# EAGLE schematic TH555-MainBoard (EAGLE 7.5.0)
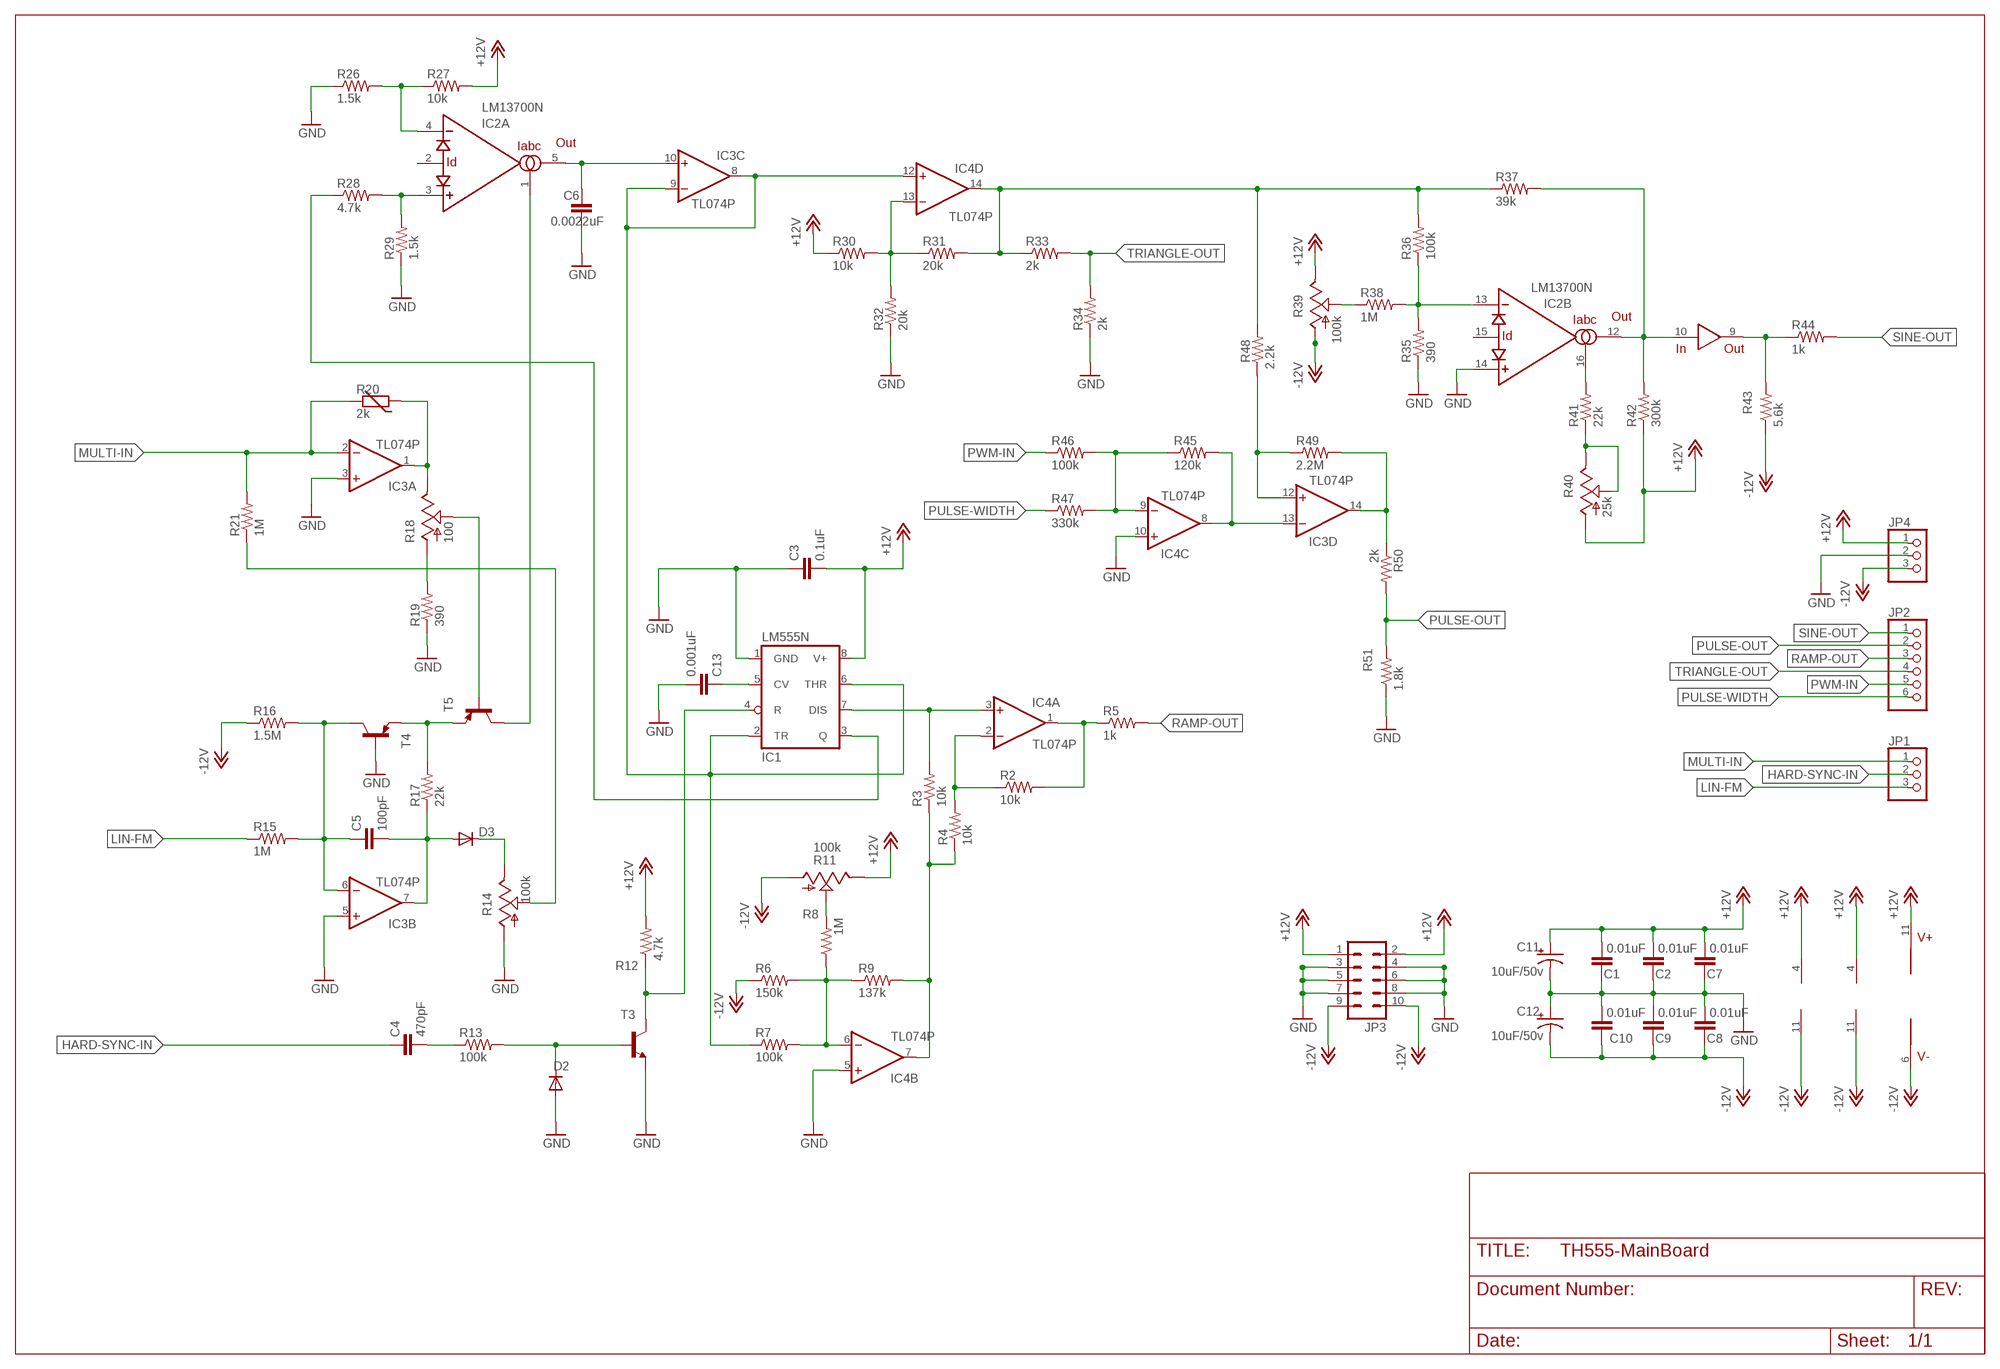
[diagram p0: schematic, sheet 1]

## Parts
C1  0.01uF  C-EU050-024X044  [C050-024X044]
C2  0.01uF  C-EU050-024X044  [C050-024X044]
C3  0.1uF  C-EU050-024X044  [C050-024X044]
C4  470pF  C-EU050-024X044  [C050-024X044]
C5  100pF  C-EU050-024X044  [C050-024X044]
C6  0.0022uF  C-EU050-025X075  [C050-025X075]
C7  0.01uF  C-EU050-024X044  [C050-024X044]
C8  0.01uF  C-EU050-024X044  [C050-024X044]
C9  0.01uF  C-EU050-024X044  [C050-024X044]
C10  0.01uF  C-EU050-024X044  [C050-024X044]
C11  10uF/50v  CPOL-USE2.5-6  [E2,5-6]
C12  10uF/50v  CPOL-USE2.5-6  [E2,5-6]
C13  0.001uF  C-EU050-024X044  [C050-024X044]
D2  1N4148DO35-7  [DO35-7]
D3  1N4148DO35-7  [DO35-7]
IC1  LM555N  [DIL08]
IC2  LM13700N  [DIL16]
IC3  TL074P  [DIL14]
IC4  TL074P  [DIL14]
JP1  PINHD-1X3  [1X03]
JP2  PINHD-1X6  [1X06]
JP3  ML10  [ML10]
JP4  PINHD-1X3  [1X03]
R2  10k  R-US_0204/7  [0204/7]
R3  10k  R-US_0204/7  [0204/7]
R4  10k  R-US_0204/7  [0204/7]
R5  1k  R-US_0204/7  [0204/7]
R6  150k  R-US_0204/7  [0204/7]
R7  100k  R-US_0204/7  [0204/7]
R8  1M  R-US_0204/7  [0204/7]
R9  137k  R-US_0204/7  [0204/7]
R11  100k  TRIM_US-RJ9W  [RJ9W]
R12  4.7k  R-US_0204/7  [0204/7]
R13  100k  R-US_0204/7  [0204/7]
R14  100k  TRIM_US-RJ9W  [RJ9W]
R15  1M  R-US_0204/7  [0204/7]
R16  1.5M  R-US_0204/7  [0204/7]
R17  22k  R-US_0204/7  [0204/7]
R18  100  TRIM_US-RJ9W  [RJ9W]
R19  390  R-US_0204/7  [0204/7]
R20  2k  THERMISTOR-5  [R-5]
R21  1M  R-US_0204/7  [0204/7]
R26  1.5k  R-US_0204/7  [0204/7]
R27  10k  R-US_0204/7  [0204/7]
R28  4.7k  R-US_0204/7  [0204/7]
R29  1.5k  R-US_0204/7  [0204/7]
R30  10k  R-US_0204/7  [0204/7]
R31  20k  R-US_0204/7  [0204/7]
R32  20k  R-US_0204/7  [0204/7]
R33  2k  R-US_0204/7  [0204/7]
R34  2k  R-US_0204/7  [0204/7]
R35  390  R-US_0204/7  [0204/7]
R36  100k  R-US_0204/7  [0204/7]
R37  39k  R-US_0204/7  [0204/7]
R38  1M  R-US_0204/7  [0204/7]
R39  100k  TRIM_US-RJ9W  [RJ9W]
R40  25k  TRIM_US-RJ9W  [RJ9W]
R41  22k  R-US_0204/7  [0204/7]
R42  300k  R-US_0204/7  [0204/7]
R43  5.6k  R-US_0204/7  [0204/7]
R44  1k  R-US_0204/7  [0204/7]
R45  120k  R-US_0204/7  [0204/7]
R46  100k  R-US_0204/7  [0204/7]
R47  330k  R-US_0204/7  [0204/7]
R48  2.2k  R-US_0204/7  [0204/7]
R49  2.2M  R-US_0204/7  [0204/7]
R50  2k  R-US_0204/7  [0204/7]
R51  1.8k  R-US_0204/7  [0204/7]
T3  2N3904-NPN-TO92-EBC  [TO92-EBC]
T4  2N3906-PNP-TO92-EBC  [TO92-EBC]
T5  2N3906-PNP-TO92-EBC  [TO92-EBC]

## Nets
+12V: C1.2 C2.2 C3.2 C7.2 C11.+ IC1.8(V+) IC2.11(V+) IC3.4(P:V+) IC4.4(P:V+) JP3.1 JP3.2 JP4.1 R11.E R12.2 R27.2 R30.1 R39.E R40.A R42.1
-12V: C8.1 C9.1 C10.1 C12.- IC2.6(V-) IC3.11(P:V-) IC4.11(P:V-) JP3.9 JP3.10 JP4.3 R6.1 R11.A R16.1 R39.A R43.1
GND: C1.1 C2.1 C3.1 C6.2 C7.1 C8.2 C9.2 C10.2 C11.- C12.+ C13.1 D2.A IC1.1(GND) IC2.14(B:+IN) IC3.3(A:+IN) IC3.5(B:+IN) IC4.5(B:+IN) IC4.10(C:+IN) JP3.3 JP3.4 JP3.5 JP3.6 JP3.7 JP3.8 JP4.2 R14.A R19.1 R26.1 R29.1 R32.1 R34.1 R35.1 R51.1 T3.E T4.B
HARD-SYNC-IN: C4.1 JP1.2
LIN-FM: JP1.3 R15.1
MULTI-IN: IC3.2(A:-IN) JP1.1 R20.2 R21.2
N$1: IC1.7(DIS) IC4.3(A:+IN) R3.2
N$2: IC4.2(A:-IN) R2.1 R4.2
N$3: IC4.1(A:OUT) R2.2 R5.1
N$4: IC4.7(B:OUT) R3.1 R4.1 R9.2
N$5: IC4.6(B:-IN) R6.2 R7.2 R8.1 R9.1
N$7: R38.1 R39.S
N$8: C5.1 IC3.6(B:-IN) R15.2 R16.2 T4.C
N$9: R8.2 R11.S
N$10: C5.2 D3.A IC3.7(B:OUT) R17.1
N$11: C4.2 R13.1
N$12: D2.C R13.2 T3.B
N$13: IC1.4(R) R12.1 T3.C
N$14: R17.2 T4.E T5.E
N$15: D3.C R14.E
N$16: R14.S R21.1
N$17: IC3.1(A:OUT) R18.E R20.1
N$18: R18.S T5.B
N$19: IC2.1(A:IABC) T5.C
N$20: R18.A R19.2
N$22: IC2.3(A:+IN) R28.2 R29.2
N$23: IC1.3(Q) R28.1
N$24: IC2.4(A:-IN) R26.2 R27.1
N$25: C6.1 IC2.5(A:OUT) IC3.10(C:+IN)
N$26: IC1.2(TR) IC1.6(THR) IC3.8(C:OUT) IC3.9(C:-IN) IC4.12(D:+IN) R7.1
N$27: IC4.13(D:-IN) R30.2 R31.1 R32.2
N$28: IC2.13(B:-IN) R35.2 R36.1 R38.2
N$29: IC4.14(D:OUT) R31.2 R33.1 R36.2 R37.1 R48.2
N$30: IC2.16(B:IABC) R41.2
N$31: R40.E R40.S R41.1
N$32: IC2.10(IN) IC2.12(B:OUT) R37.2 R42.2
N$33: IC2.9(OUT) R43.2 R44.1
N$34: IC3.13(D:-IN) IC4.8(C:OUT) R45.2
N$35: C13.2 IC1.5(CV)
N$37: IC4.9(C:-IN) R45.1 R46.2 R47.2
N$41: IC3.12(D:+IN) R48.1 R49.1
N$42: IC3.14(D:OUT) R49.2 R50.1
PULSE-OUT: JP2.2 R50.2 R51.2
PULSE-WIDTH: JP2.6 R47.1
PWM-IN: JP2.5 R46.1
RAMP-OUT: JP2.3 R5.2
SINE-OUT: JP2.1 R44.2
TRIANGLE-OUT: JP2.4 R33.2 R34.2
Unconnected: IC2.2(A:ID) IC2.7(IN) IC2.8(OUT) IC2.15(B:ID)

## Library data of the parts
C1-C10 C13 = resistor:C-EU: CAPACITOR, European symbol
C11 C12 = resistor:CPOL-US: POLARIZED CAPACITOR, American symbol
D2 D3 = diode:1N4148: DIODE high speed (Philips)
IC1 = linear:*555: TIMER
IC2 = synthdiy:LM13700: National Dual OTA with buffers.
IC3 IC4 = linear:TL074: OP AMP
JP1 JP4 = pinhead:PINHD-1X3: PIN HEADER
JP2 = pinhead:PINHD-1X6: PIN HEADER
JP3 = con-ml:ML10: HARTING; OC_FARNELL: unknown; OC_NEWARK: unknown
R2-R9 R12 R13 R15-R17 R19 R21 R26-R38 R41-R51 = resistor:R-US_: RESISTOR, American symbol
R11 R14 R18 R39 R40 = pot:TRIM_US-: POTENTIOMETER
R20 = varistor:THERMISTOR: THERMISTOR
T3 = transistor-neu-to92:*-NPN-: NPN Transistror
T4 T5 = transistor-neu-to92:*-PNP-: PNP Transistror